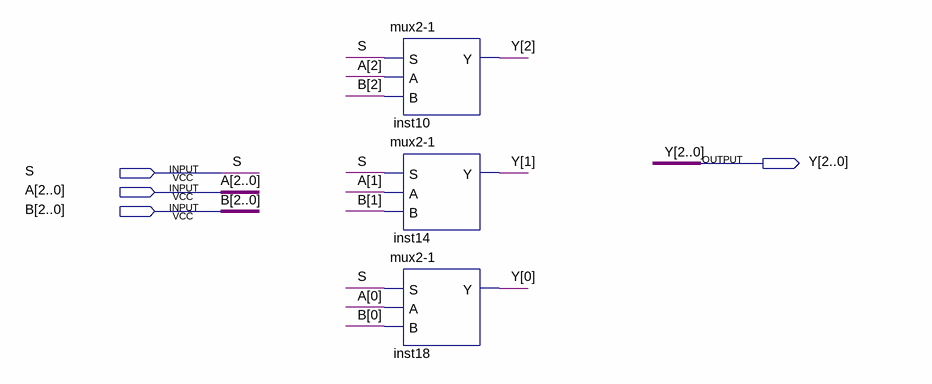
[diagram p0: schematic sheet]
// Quartus schematic mux2-1_3bit.bdf as structural Verilog: 3 symbols, 4 pins
module \mux2-1_3bit  (
  input  S,
  input  [2:0] A,
  input  [2:0] B,
  output [2:0] Y
);

  \mux2-1  inst10 (.S(S), .A(A[2]), .B(B[2]), .Y(Y[2]));
  \mux2-1  inst14 (.S(S), .A(A[1]), .B(B[1]), .Y(Y[1]));
  \mux2-1  inst18 (.S(S), .A(A[0]), .B(B[0]), .Y(Y[0]));
endmodule
